# EAGLE schematic registers_full_wires (EAGLE 9.5.2)
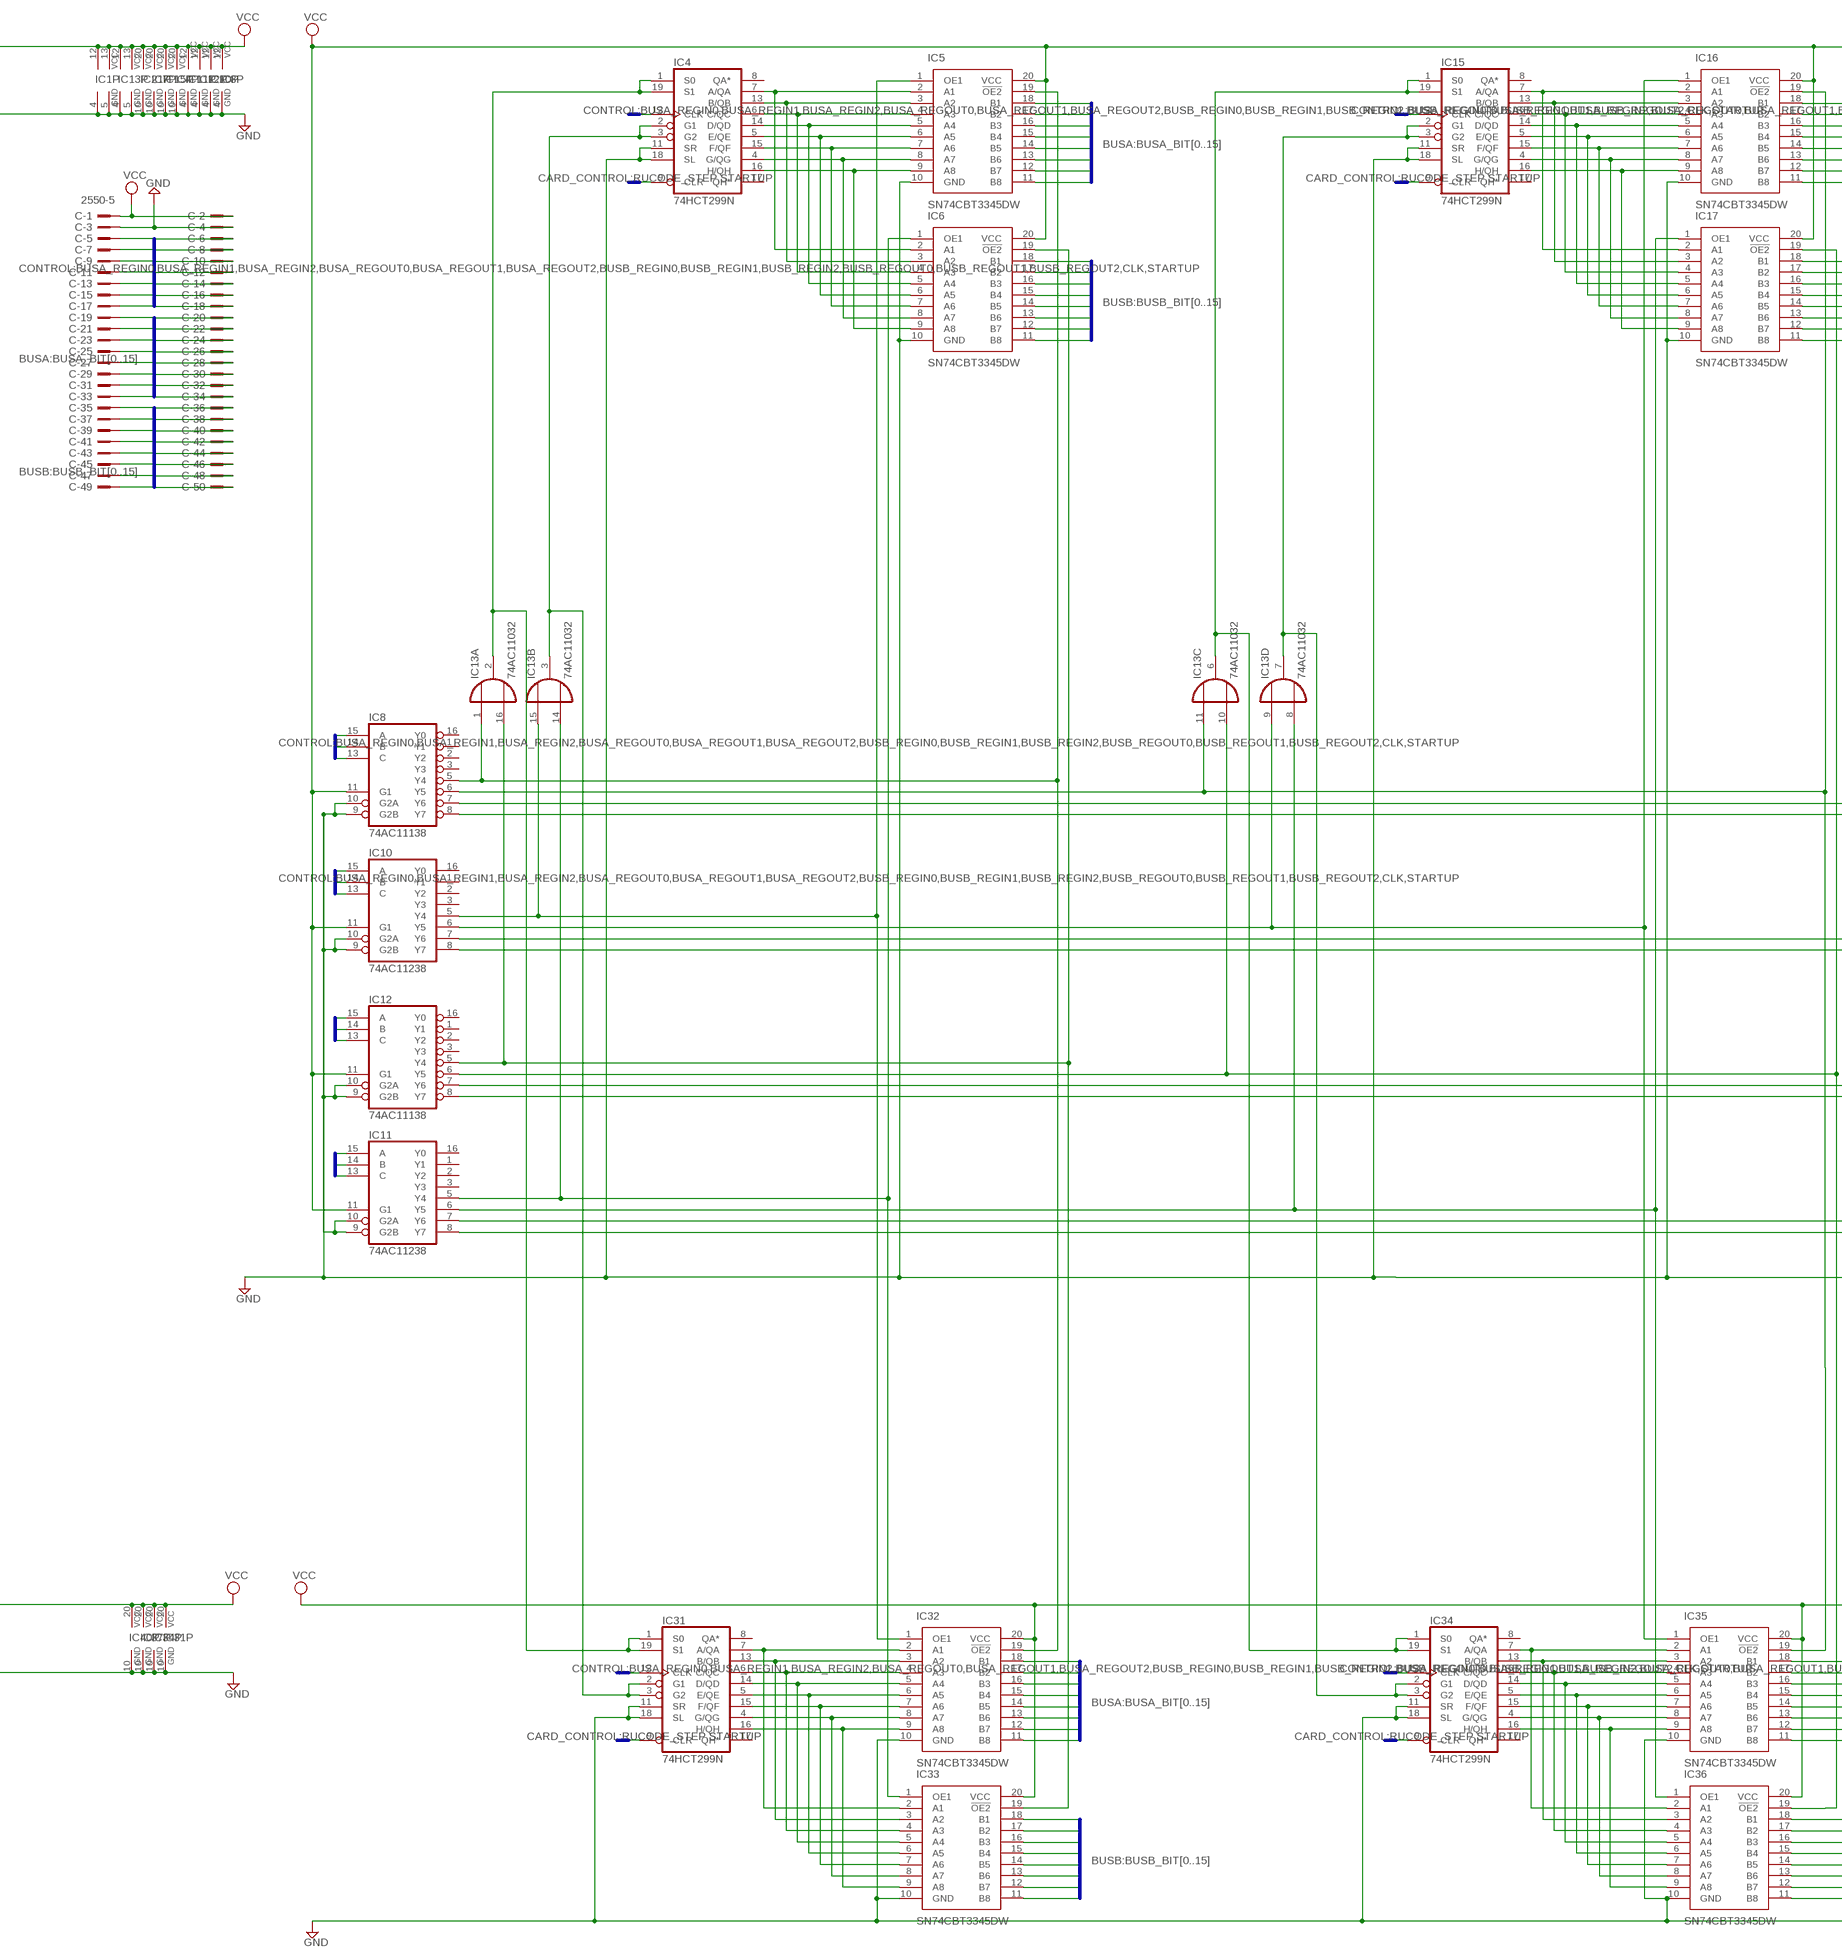
[diagram p0: schematic, sheet 1, part 1 of 2]
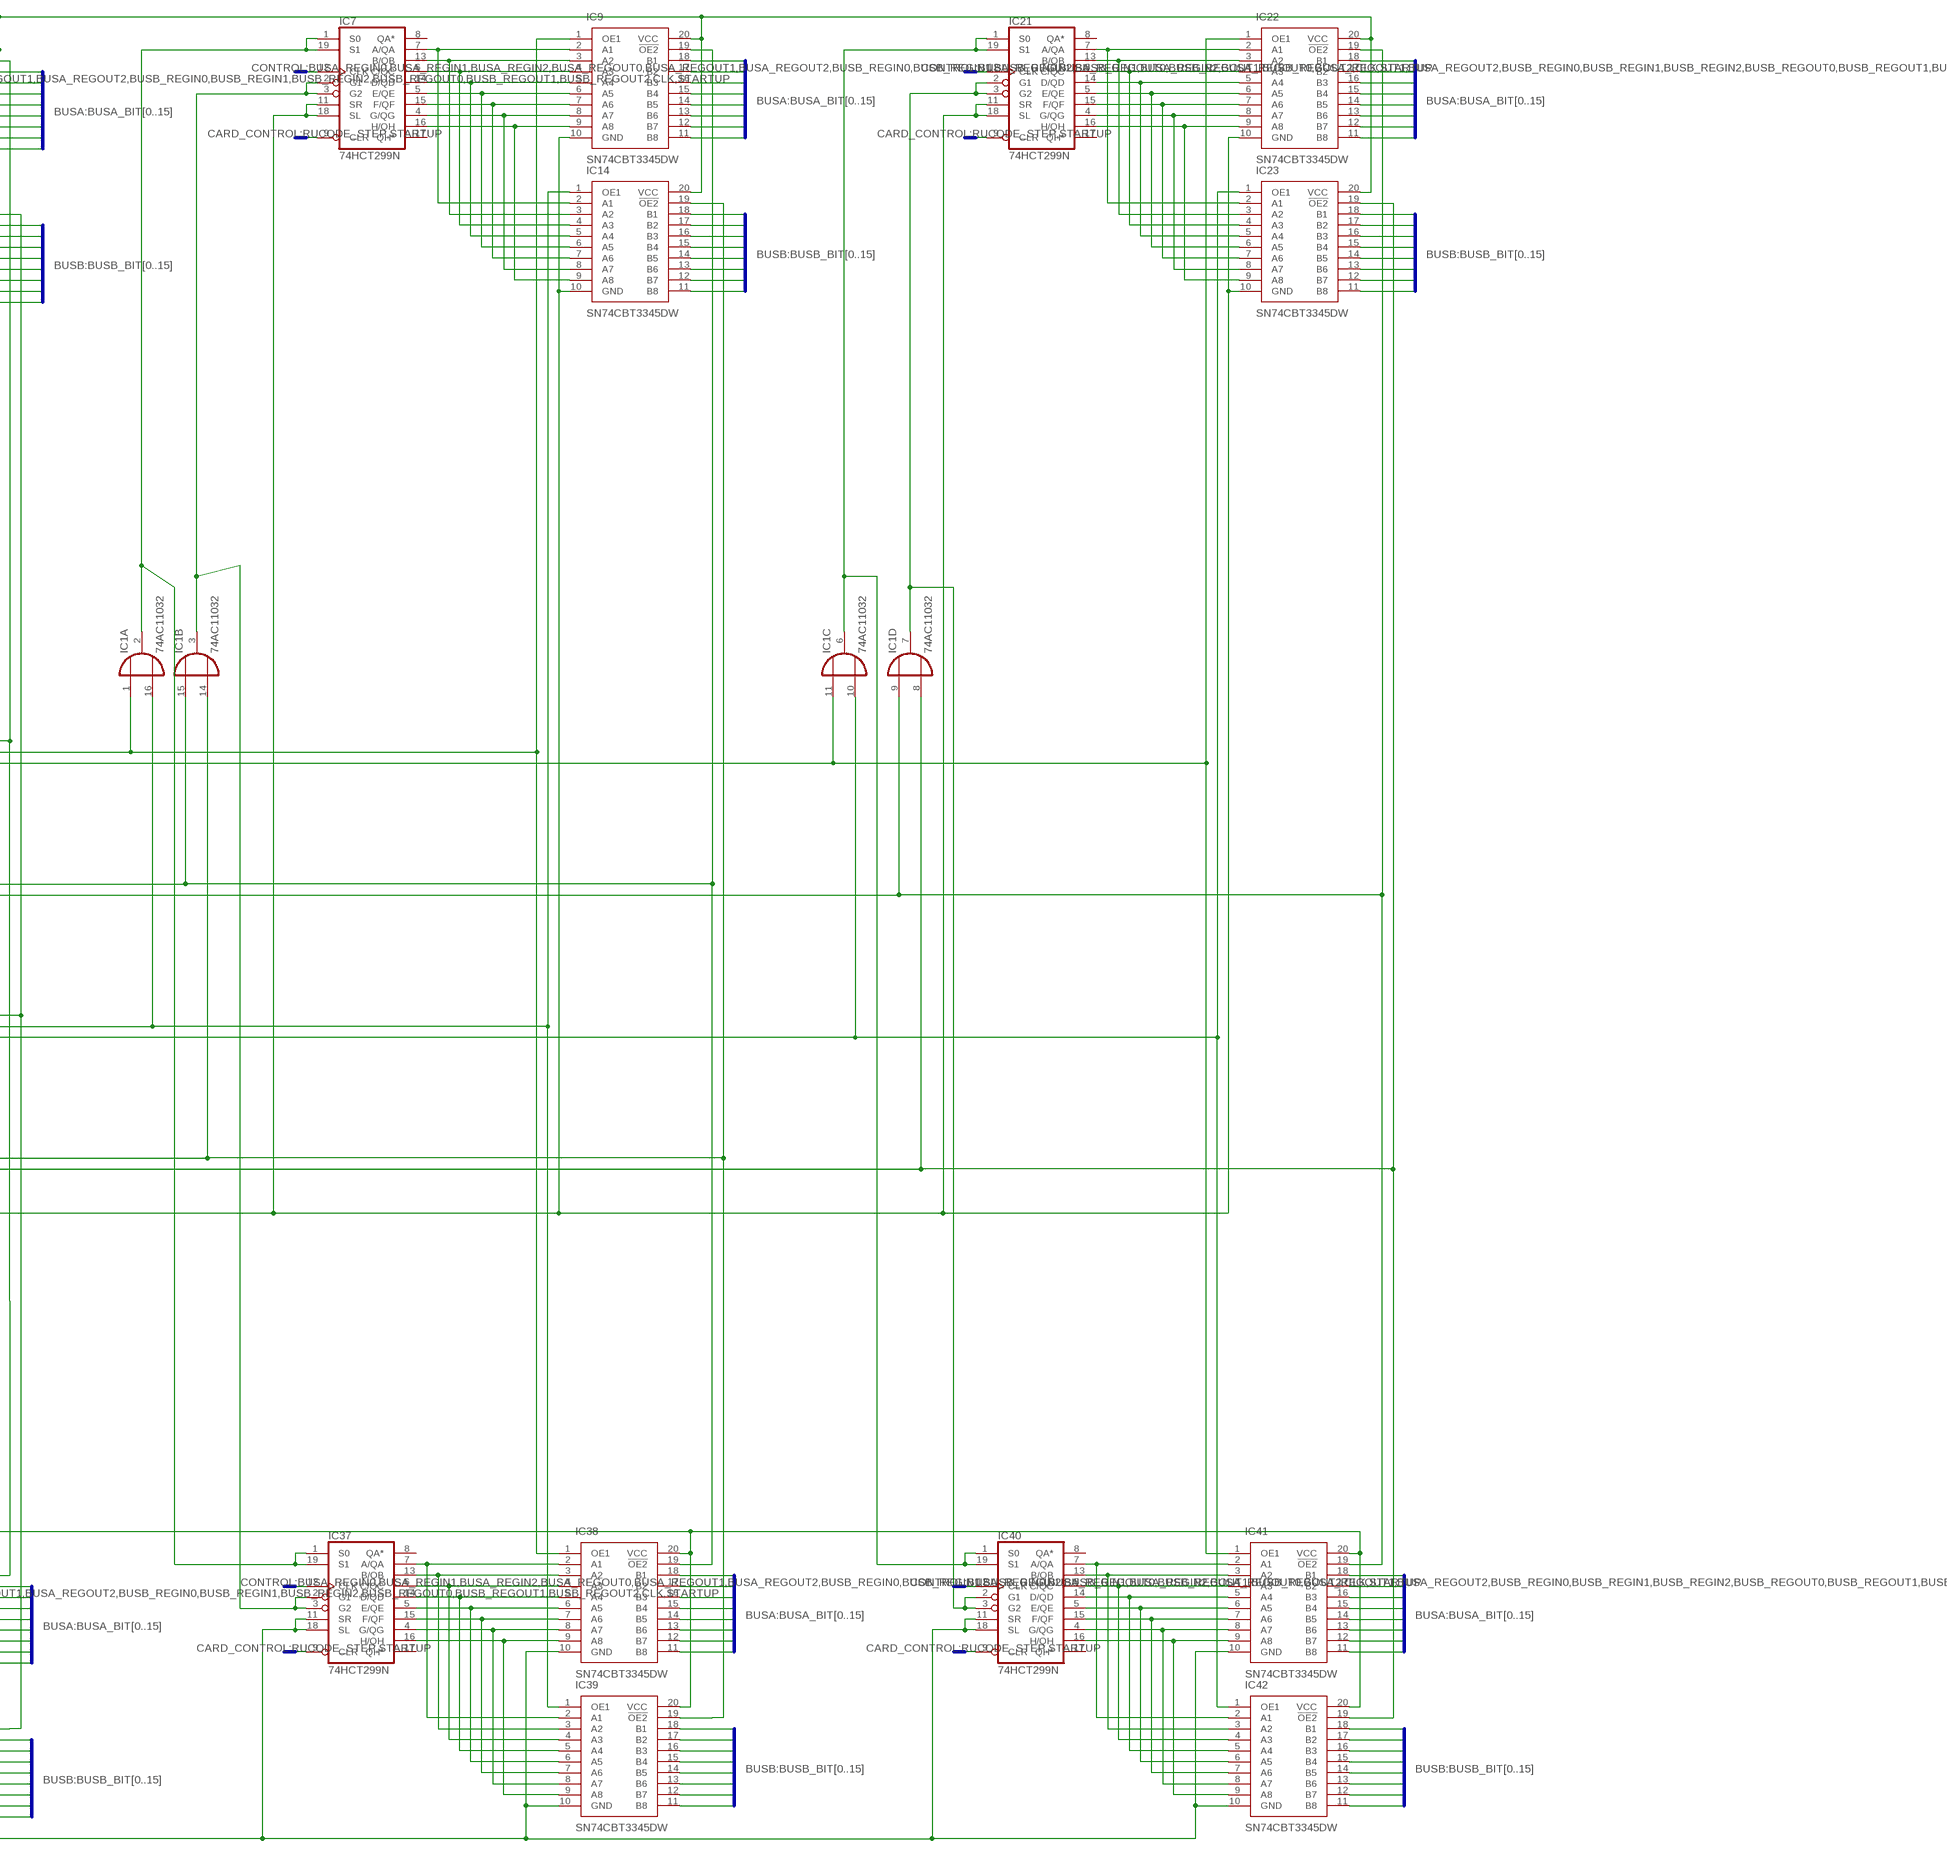
[diagram p1: schematic, sheet 1, part 2 of 2]

## Parts
C  2550-5  [PAK100/2500-5-50]
IC1  74AC11032  [DIL16]
IC4  74HCT299N  [DIL20]
IC5  SN74CBT3345DW  [SOIC127P1030X265-20N]
IC6  SN74CBT3345DW  [SOIC127P1030X265-20N]
IC7  74HCT299N  [DIL20]
IC8  74AC11138  [DIL16]
IC9  SN74CBT3345DW  [SOIC127P1030X265-20N]
IC10  74AC11238  [DIL16]
IC11  74AC11238  [DIL16]
IC12  74AC11138  [DIL16]
IC13  74AC11032  [DIL16]
IC14  SN74CBT3345DW  [SOIC127P1030X265-20N]
IC15  74HCT299N  [DIL20]
IC16  SN74CBT3345DW  [SOIC127P1030X265-20N]
IC17  SN74CBT3345DW  [SOIC127P1030X265-20N]
IC21  74HCT299N  [DIL20]
IC22  SN74CBT3345DW  [SOIC127P1030X265-20N]
IC23  SN74CBT3345DW  [SOIC127P1030X265-20N]
IC31  74HCT299N  [DIL20]
IC32  SN74CBT3345DW  [SOIC127P1030X265-20N]
IC33  SN74CBT3345DW  [SOIC127P1030X265-20N]
IC34  74HCT299N  [DIL20]
IC35  SN74CBT3345DW  [SOIC127P1030X265-20N]
IC36  SN74CBT3345DW  [SOIC127P1030X265-20N]
IC37  74HCT299N  [DIL20]
IC38  SN74CBT3345DW  [SOIC127P1030X265-20N]
IC39  SN74CBT3345DW  [SOIC127P1030X265-20N]
IC40  74HCT299N  [DIL20]
IC41  SN74CBT3345DW  [SOIC127P1030X265-20N]
IC42  SN74CBT3345DW  [SOIC127P1030X265-20N]

## Nets
BUSA_BIT0: C.19 IC5.18(B1) IC9.18(B1) IC16.18(B1) IC22.18(B1)
BUSA_BIT1: C.20 IC5.17(B2) IC9.17(B2) IC16.17(B2) IC22.17(B2)
BUSA_BIT2: C.21 IC5.16(B3) IC9.16(B3) IC16.16(B3) IC22.16(B3)
BUSA_BIT3: C.22 IC5.15(B4) IC9.15(B4) IC16.15(B4) IC22.15(B4)
BUSA_BIT4: C.23 IC5.14(B5) IC9.14(B5) IC16.14(B5) IC22.14(B5)
BUSA_BIT5: C.24 IC5.13(B6) IC9.13(B6) IC16.13(B6) IC22.13(B6)
BUSA_BIT6: C.25 IC5.12(B7) IC9.12(B7) IC16.12(B7) IC22.12(B7)
BUSA_BIT7: C.26 IC5.11(B8) IC9.11(B8) IC16.11(B8) IC22.11(B8)
BUSA_BIT8: C.27 IC32.18(B1) IC35.18(B1) IC38.18(B1) IC41.18(B1)
BUSA_BIT9: C.28 IC32.17(B2) IC35.17(B2) IC38.17(B2) IC41.17(B2)
BUSA_BIT10: C.29 IC32.16(B3) IC35.16(B3) IC38.16(B3) IC41.16(B3)
BUSA_BIT11: C.30 IC32.15(B4) IC35.15(B4) IC38.15(B4) IC41.15(B4)
BUSA_BIT12: C.31 IC32.14(B5) IC35.14(B5) IC38.14(B5) IC41.14(B5)
BUSA_BIT13: C.32 IC32.13(B6) IC35.13(B6) IC38.13(B6) IC41.13(B6)
BUSA_BIT14: C.33 IC32.12(B7) IC35.12(B7) IC38.12(B7) IC41.12(B7)
BUSA_BIT15: C.34 IC32.11(B8) IC35.11(B8) IC38.11(B8) IC41.11(B8)
BUSA_REGIN0: C.7 IC8.15(A)
BUSA_REGIN1: C.9 IC8.14(B)
BUSA_REGIN2: C.11 IC8.13(C)
BUSA_REGOUT0: C.13 IC10.15(A)
BUSA_REGOUT1: C.15 IC10.14(B)
BUSA_REGOUT2: C.17 IC10.13(C)
BUSB_BIT0: C.35 IC6.18(B1) IC14.18(B1) IC17.18(B1) IC23.18(B1)
BUSB_BIT1: C.36 IC6.17(B2) IC14.17(B2) IC17.17(B2) IC23.17(B2)
BUSB_BIT2: C.37 IC6.16(B3) IC14.16(B3) IC17.16(B3) IC23.16(B3)
BUSB_BIT3: C.38 IC6.15(B4) IC14.15(B4) IC17.15(B4) IC23.15(B4)
BUSB_BIT4: C.39 IC6.14(B5) IC14.14(B5) IC17.14(B5) IC23.14(B5)
BUSB_BIT5: C.40 IC6.13(B6) IC14.13(B6) IC17.13(B6) IC23.13(B6)
BUSB_BIT6: C.41 IC6.12(B7) IC14.12(B7) IC17.12(B7) IC23.12(B7)
BUSB_BIT7: C.42 IC6.11(B8) IC14.11(B8) IC17.11(B8) IC23.11(B8)
BUSB_BIT8: C.43 IC33.18(B1) IC36.18(B1) IC39.18(B1) IC42.18(B1)
BUSB_BIT9: C.44 IC33.17(B2) IC36.17(B2) IC39.17(B2) IC42.17(B2)
BUSB_BIT10: C.45 IC33.16(B3) IC36.16(B3) IC39.16(B3) IC42.16(B3)
BUSB_BIT11: C.46 IC33.15(B4) IC36.15(B4) IC39.15(B4) IC42.15(B4)
BUSB_BIT12: C.47 IC33.14(B5) IC36.14(B5) IC39.14(B5) IC42.14(B5)
BUSB_BIT13: C.48 IC33.13(B6) IC36.13(B6) IC39.13(B6) IC42.13(B6)
BUSB_BIT14: C.49 IC33.12(B7) IC36.12(B7) IC39.12(B7) IC42.12(B7)
BUSB_BIT15: C.50 IC33.11(B8) IC36.11(B8) IC39.11(B8) IC42.11(B8)
BUSB_REGIN0: C.8 IC12.15(A)
BUSB_REGIN1: C.10 IC12.14(B)
BUSB_REGIN2: C.12 IC12.13(C)
BUSB_REGOUT0: C.14 IC11.15(A)
BUSB_REGOUT1: C.16 IC11.14(B)
BUSB_REGOUT2: C.18 IC11.13(C)
CLK: C.5 IC4.12(CLK) IC7.12(CLK) IC15.12(CLK) IC21.12(CLK) IC31.12(CLK) IC34.12(CLK) IC37.12(CLK) IC40.12(CLK)
GND: C.3 C.4 IC1.4(P:GND) IC1.5(P:GND) IC4.10(GND) IC4.11(SR) IC4.18(SL) IC5.10(GND) IC6.10(GND) IC7.10(GND) IC7.11(SR) IC7.18(SL) IC8.4(GND) IC8.9(G2B) IC8.10(G2A) IC9.10(GND) IC10.4(GND) IC10.9(G2B) IC10.10(G2A) IC11.4(GND) IC11.9(G2B) IC11.10(G2A) IC12.4(GND) IC12.9(G2B) IC12.10(G2A) IC13.4(P:GND) IC13.5(P:GND) IC14.10(GND) IC15.10(GND) IC15.11(SR) IC15.18(SL) IC16.10(GND) IC17.10(GND) IC21.10(GND) IC21.11(SR) IC21.18(SL) IC22.10(GND) IC23.10(GND) IC31.10(GND) IC31.11(SR) IC31.18(SL) IC32.10(GND) IC33.10(GND) IC34.10(GND) IC34.11(SR) IC34.18(SL) IC35.10(GND) IC36.10(GND) IC37.10(GND) IC37.11(SR) IC37.18(SL) IC38.10(GND) IC39.10(GND) IC40.10(GND) IC40.11(SR) IC40.18(SL) IC41.10(GND) IC42.10(GND)
N$1: IC34.16(H/QH) IC35.9(A8) IC36.9(A8)
N$2: IC1.8(D:I2) IC11.8(Y7) IC23.19(!OE2) IC42.19(!OE2)
N$5: IC4.7(A/QA) IC5.2(A1) IC6.2(A1)
N$6: IC4.13(B/QB) IC5.3(A2) IC6.3(A2)
N$7: IC4.6(C/QC) IC5.4(A3) IC6.4(A3)
N$8: IC4.14(D/QD) IC5.5(A4) IC6.5(A4)
N$9: IC4.5(E/QE) IC5.6(A5) IC6.6(A5)
N$10: IC4.15(F/QF) IC5.7(A6) IC6.7(A6)
N$11: IC4.4(G/QG) IC5.8(A7) IC6.8(A7)
N$15: IC4.16(H/QH) IC5.9(A8) IC6.9(A8)
N$22: IC7.7(A/QA) IC9.2(A1) IC14.2(A1)
N$23: IC7.13(B/QB) IC9.3(A2) IC14.3(A2)
N$24: IC7.6(C/QC) IC9.4(A3) IC14.4(A3)
N$25: IC7.14(D/QD) IC9.5(A4) IC14.5(A4)
N$28: IC7.5(E/QE) IC9.6(A5) IC14.6(A5)
N$34: IC5.1(OE1) IC10.5(Y4) IC13.15(B:I1) IC32.1(OE1)
N$35: IC7.15(F/QF) IC9.7(A6) IC14.7(A6)
N$36: IC7.4(G/QG) IC9.8(A7) IC14.8(A7)
N$37: IC7.16(H/QH) IC9.9(A8) IC14.9(A8)
N$41: IC15.7(A/QA) IC16.2(A1) IC17.2(A1)
N$42: IC15.13(B/QB) IC16.3(A2) IC17.3(A2)
N$43: IC15.6(C/QC) IC16.4(A3) IC17.4(A3)
N$44: IC15.14(D/QD) IC16.5(A4) IC17.5(A4)
N$45: IC15.5(E/QE) IC16.6(A5) IC17.6(A5)
N$46: IC15.15(F/QF) IC16.7(A6) IC17.7(A6)
N$47: IC15.4(G/QG) IC16.8(A7) IC17.8(A7)
N$48: IC15.16(H/QH) IC16.9(A8) IC17.9(A8)
N$63: IC21.7(A/QA) IC22.2(A1) IC23.2(A1)
N$64: IC21.13(B/QB) IC22.3(A2) IC23.3(A2)
N$65: IC21.6(C/QC) IC22.4(A3) IC23.4(A3)
N$66: IC21.14(D/QD) IC22.5(A4) IC23.5(A4)
N$67: IC21.5(E/QE) IC22.6(A5) IC23.6(A5)
N$68: IC21.15(F/QF) IC22.7(A6) IC23.7(A6)
N$69: IC21.4(G/QG) IC22.8(A7) IC23.8(A7)
N$70: IC21.16(H/QH) IC22.9(A8) IC23.9(A8)
N$120: IC5.19(!OE2) IC8.5(Y4) IC13.1(A:I1) IC32.19(!OE2)
N$121: IC31.7(A/QA) IC32.2(A1) IC33.2(A1)
N$122: IC31.13(B/QB) IC32.3(A2) IC33.3(A2)
N$124: IC6.19(!OE2) IC12.5(Y4) IC13.16(A:I2) IC33.19(!OE2)
N$125: IC31.6(C/QC) IC32.4(A3) IC33.4(A3)
N$126: IC31.14(D/QD) IC32.5(A4) IC33.5(A4)
N$127: IC4.2(G1) IC4.3(G2) IC13.3(B:O) IC31.2(G1) IC31.3(G2)
N$128: IC4.1(S0) IC4.19(S1) IC13.2(A:O) IC31.1(S0) IC31.19(S1)
N$129: IC31.5(E/QE) IC32.6(A5) IC33.6(A5)
N$130: IC31.15(F/QF) IC32.7(A6) IC33.7(A6)
N$131: IC31.4(G/QG) IC32.8(A7) IC33.8(A7)
N$132: IC31.16(H/QH) IC32.9(A8) IC33.9(A8)
N$133: IC34.7(A/QA) IC35.2(A1) IC36.2(A1)
N$134: IC34.13(B/QB) IC35.3(A2) IC36.3(A2)
N$135: IC34.6(C/QC) IC35.4(A3) IC36.4(A3)
N$136: IC34.14(D/QD) IC35.5(A4) IC36.5(A4)
N$137: IC13.7(D:O) IC15.2(G1) IC15.3(G2) IC34.2(G1) IC34.3(G2)
N$138: IC13.6(C:O) IC15.1(S0) IC15.19(S1) IC34.1(S0) IC34.19(S1)
N$139: IC34.5(E/QE) IC35.6(A5) IC36.6(A5)
N$140: IC34.15(F/QF) IC35.7(A6) IC36.7(A6)
N$141: IC34.4(G/QG) IC35.8(A7) IC36.8(A7)
N$143: IC37.7(A/QA) IC38.2(A1) IC39.2(A1)
N$144: IC37.13(B/QB) IC38.3(A2) IC39.3(A2)
N$145: IC37.6(C/QC) IC38.4(A3) IC39.4(A3)
N$146: IC37.14(D/QD) IC38.5(A4) IC39.5(A4)
N$147: IC1.3(B:O) IC7.2(G1) IC7.3(G2) IC37.2(G1) IC37.3(G2)
N$148: IC1.2(A:O) IC7.1(S0) IC7.19(S1) IC37.1(S0) IC37.19(S1)
N$149: IC37.5(E/QE) IC38.6(A5) IC39.6(A5)
N$150: IC37.15(F/QF) IC38.7(A6) IC39.7(A6)
N$151: IC37.4(G/QG) IC38.8(A7) IC39.8(A7)
N$152: IC37.16(H/QH) IC38.9(A8) IC39.9(A8)
N$153: IC40.7(A/QA) IC41.2(A1) IC42.2(A1)
N$154: IC40.13(B/QB) IC41.3(A2) IC42.3(A2)
N$155: IC40.6(C/QC) IC41.4(A3) IC42.4(A3)
N$156: IC40.14(D/QD) IC41.5(A4) IC42.5(A4)
N$157: IC1.7(D:O) IC21.2(G1) IC21.3(G2) IC40.2(G1) IC40.3(G2)
N$158: IC1.6(C:O) IC21.1(S0) IC21.19(S1) IC40.1(S0) IC40.19(S1)
N$159: IC40.5(E/QE) IC41.6(A5) IC42.6(A5)
N$160: IC40.15(F/QF) IC41.7(A6) IC42.7(A6)
N$161: IC40.4(G/QG) IC41.8(A7) IC42.8(A7)
N$162: IC40.16(H/QH) IC41.9(A8) IC42.9(A8)
N$163: IC6.1(OE1) IC11.5(Y4) IC13.14(B:I2) IC33.1(OE1)
N$167: IC8.6(Y5) IC13.11(C:I1) IC16.19(!OE2) IC35.19(!OE2)
N$168: IC12.6(Y5) IC13.10(C:I2) IC17.19(!OE2) IC36.19(!OE2)
N$169: IC10.6(Y5) IC13.9(D:I1) IC16.1(OE1) IC35.1(OE1)
N$170: IC11.6(Y5) IC13.8(D:I2) IC17.1(OE1) IC36.1(OE1)
N$171: IC1.1(A:I1) IC8.7(Y6) IC9.1(OE1) IC38.1(OE1)
N$172: IC1.16(A:I2) IC12.7(Y6) IC14.1(OE1) IC39.1(OE1)
N$173: IC1.15(B:I1) IC9.19(!OE2) IC10.7(Y6) IC38.19(!OE2)
N$174: IC1.14(B:I2) IC11.7(Y6) IC14.19(!OE2) IC39.19(!OE2)
N$176: IC1.9(D:I1) IC10.8(Y7) IC22.19(!OE2) IC41.19(!OE2)
N$178: IC1.10(C:I2) IC12.8(Y7) IC23.1(OE1) IC42.1(OE1)
N$207: IC1.11(C:I1) IC8.8(Y7) IC22.1(OE1) IC41.1(OE1)
STARTUP: C.6 IC4.9(CLR) IC7.9(CLR) IC15.9(CLR) IC21.9(CLR) IC31.9(CLR) IC34.9(CLR) IC37.9(CLR) IC40.9(CLR)
VCC: C.1 C.2 IC1.12(P:VCC) IC1.13(P:VCC) IC4.20(VCC) IC5.20(VCC) IC6.20(VCC) IC7.20(VCC) IC8.11(G1) IC8.12(VCC) IC9.20(VCC) IC10.11(G1) IC10.12(VCC) IC11.11(G1) IC11.12(VCC) IC12.11(G1) IC12.12(VCC) IC13.12(P:VCC) IC13.13(P:VCC) IC14.20(VCC) IC15.20(VCC) IC16.20(VCC) IC17.20(VCC) IC21.20(VCC) IC22.20(VCC) IC23.20(VCC) IC31.20(VCC) IC32.20(VCC) IC33.20(VCC) IC34.20(VCC) IC35.20(VCC) IC36.20(VCC) IC37.20(VCC) IC38.20(VCC) IC39.20(VCC) IC40.20(VCC) IC41.20(VCC) IC42.20(VCC)
Unconnected: IC4.8(QA*) IC4.17(QH*) IC7.8(QA*) IC7.17(QH*) IC8.1(Y1) IC8.2(Y2) IC8.3(Y3) IC8.16(Y0) IC10.1(Y1) IC10.2(Y2) IC10.3(Y3) IC10.16(Y0) IC11.1(Y1) IC11.2(Y2) IC11.3(Y3) IC11.16(Y0) IC12.1(Y1) IC12.2(Y2) IC12.3(Y3) IC12.16(Y0) IC15.8(QA*) IC15.17(QH*) IC21.8(QA*) IC21.17(QH*) IC31.8(QA*) IC31.17(QH*) IC34.8(QA*) IC34.17(QH*) IC37.8(QA*) IC37.17(QH*) IC40.8(QA*) IC40.17(QH*)

## Buses
CONTROL:BUSA_REGIN0,BUSA_REGIN1,BUSA_REGIN2,BUSA_REGOUT0,BUSA_REGOUT1,BUSA_REGOUT2,BUSB_REGIN0,BUSB_REGIN1,BUSB_REGIN2,BUSB_REGOUT0,BUSB_REGOUT1,BUSB_REGOUT2,CLK,STARTUP
CARD_CONTROL:RUCODE_STEP,STARTUP
BUSA:BUSA_BIT[0..15]
BUSB:BUSB_BIT[0..15]

## Library data of the parts
C = con-3m:2550-: 3M (TM) Pak 100 4-Wall Header Source: 3M; OC_FARNELL: 1788696; OC_NEWARK: unknown
IC1 IC13 = 74ac-logic:74AC11032: Quadruple 2-input OR
IC4 IC7 IC15 IC21 IC31 IC34 IC37 IC40 = 74xx-eu:74*299: 8-bit universal SHIFT/STORAGE REGISTER
IC5 IC6 IC9 IC14 IC16 IC17 IC22 IC23 IC32 IC33 IC35 IC36 IC38 IC39 IC41 IC42 = SamacSys_Parts:SN74CBT3345DW: Texas Instruments SN74CBT3345DW, Bus Switch, 8 x 1:1, 4.5 5.5 V, 20-Pin SOIC Source: Datasheet <https://www.ti.com/lit/ds/symlink/sn74cbt3345.pdf>; DESCRIPTION: Texas Instruments SN74CBT3345DW, Bus Switch, 8 x 1:1, 4.5 5.5 V, 20-Pin SOIC; HEIGHT: 2.65mm; MANUFACTURER_NAME: Texas Instruments; MANUFACTURER_PART_NUMBER: SN74CBT3345DW
IC8 IC12 = 74ac-logic:74AC11138: 3 to 8 line DECODER/DEMULTIPLEXER
IC10 IC11 = 74ac-logic:74AC11238: 3 to 8 line DECODER/DEMULTIPLEXER